# EAGLE design Battery board V4.1 - simple signals (EAGLE 7.6.0)
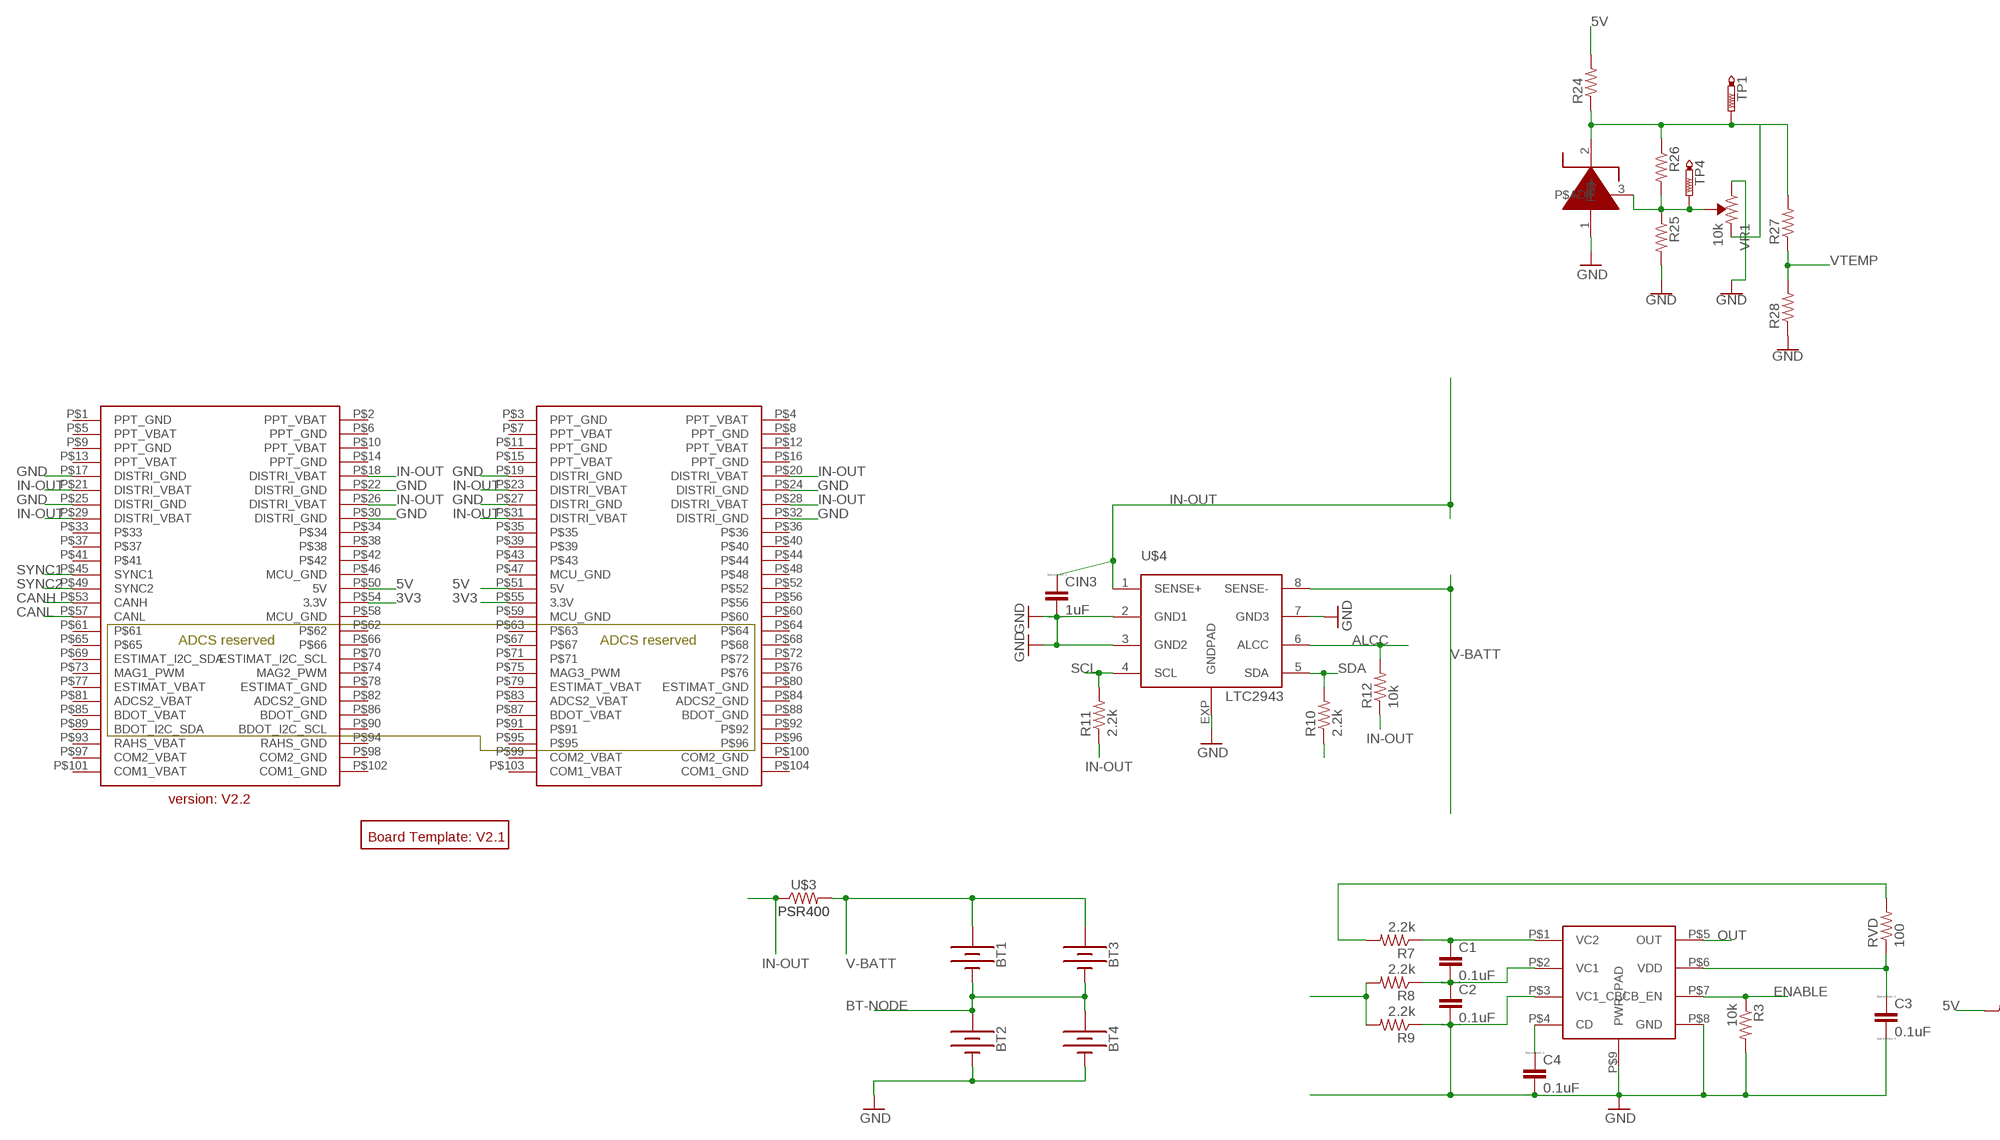
[diagram p0: schematic, sheet 1, part 1 of 2]
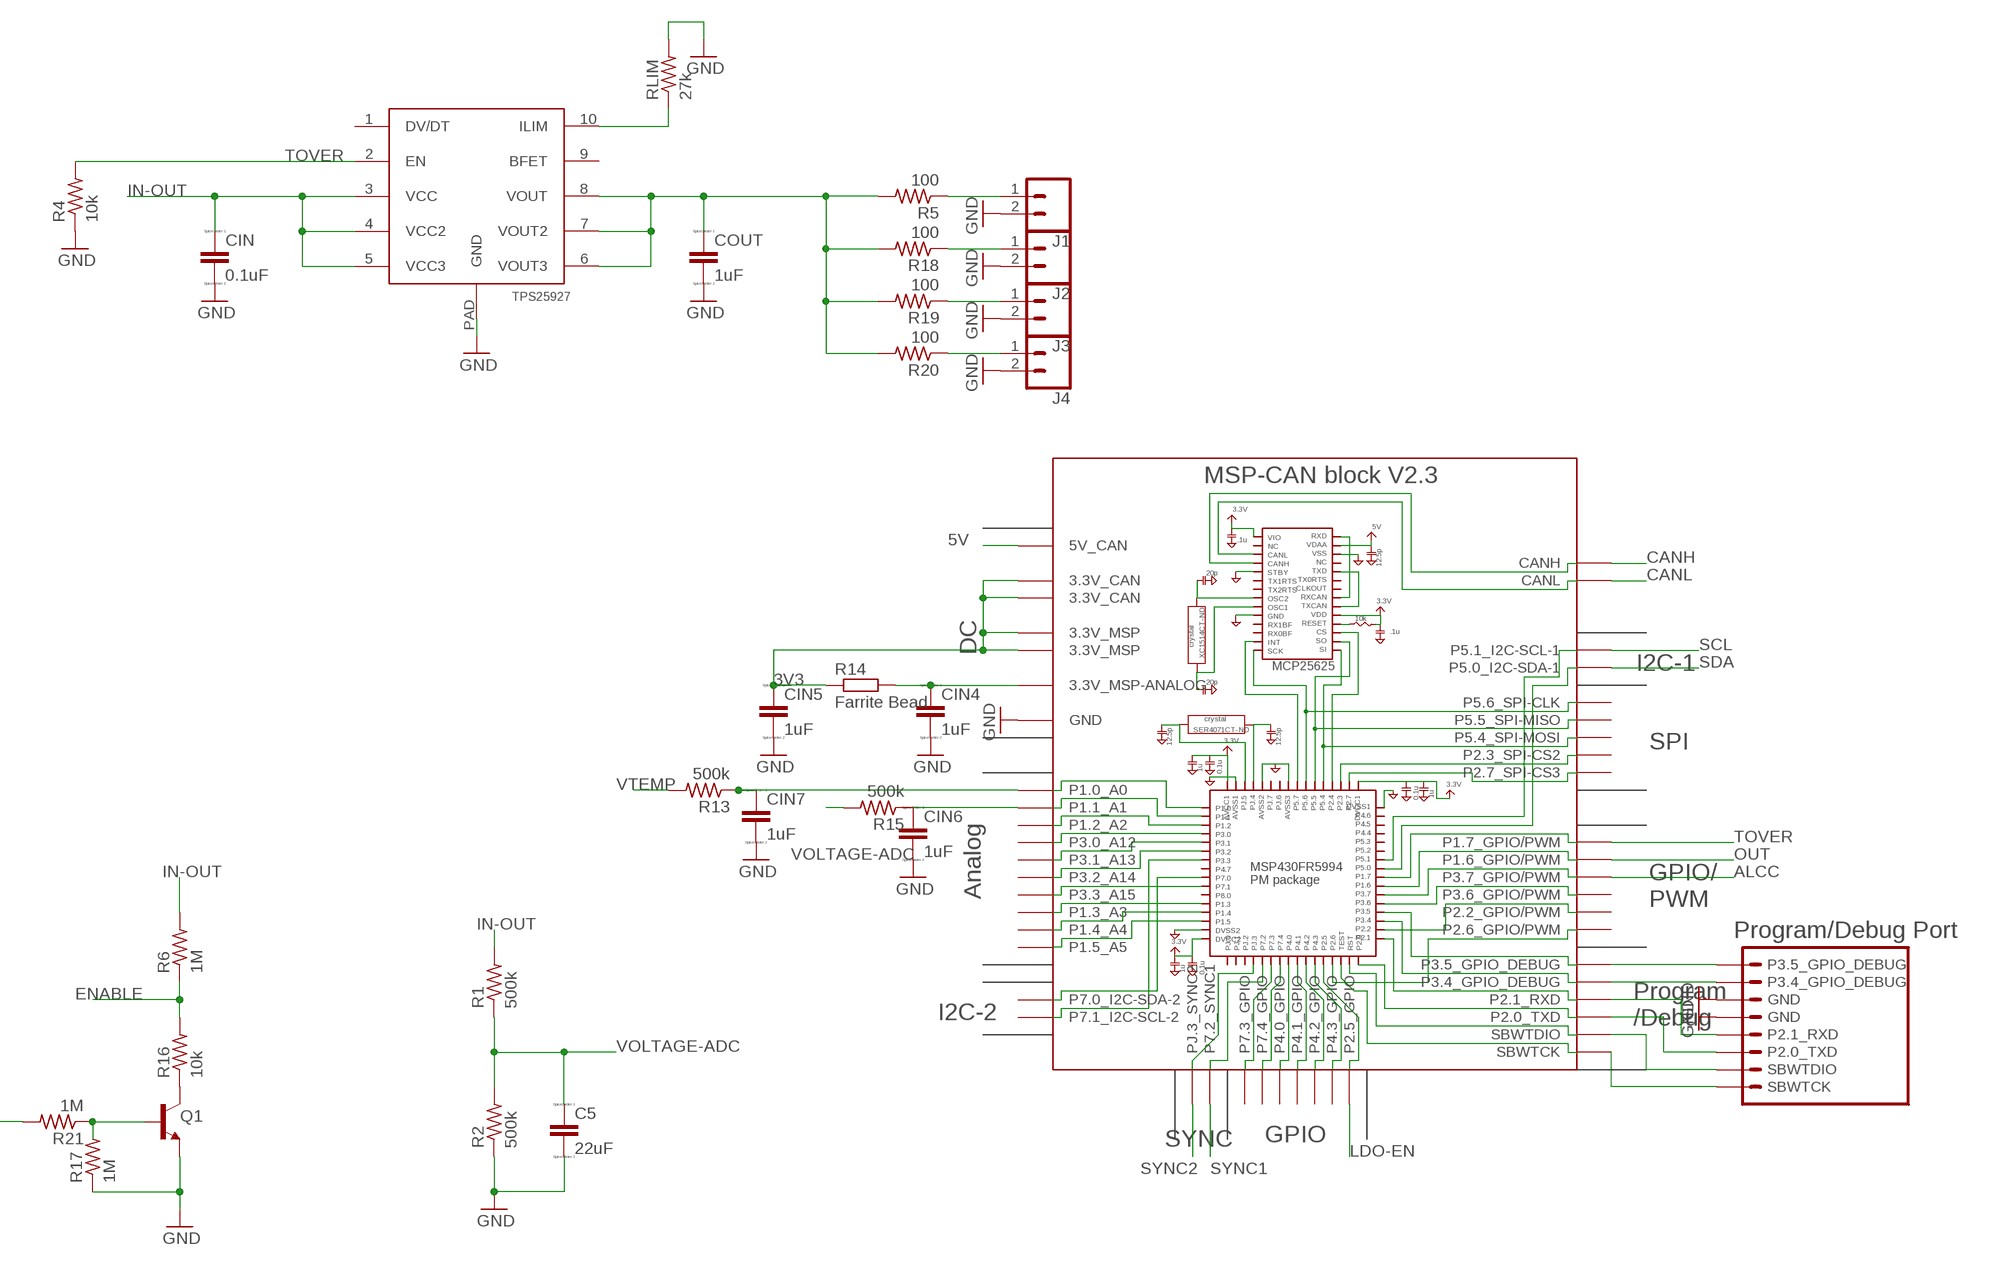
[diagram p1: schematic, sheet 1, part 2 of 2]

## Parts
BT1  BATTERY-18650  [BATTERY_18650-HOLDER]
BT2  BATTERY-18650  [BATTERY_18650-HOLDER]
BT3  BATTERY-18650  [BATTERY_18650-HOLDER]
BT4  BATTERY-18650  [BATTERY_18650-HOLDER]
C1  0.1uF  C  [C0805]
C2  0.1uF  C  [C0805]
C3  0.1uF  C  [C0805]
C4  0.1uF  C  [C0805]
C5  22uF  CC1206  [C1206]
CIN  0.1uF  C  [C0805]
CIN3  1uF  C  [C0805]
CIN4  1uF  C  [C0805]
CIN5  1uF  C  [C0805]
CIN6  1uF  C  [C0805]
CIN7  1uF  C  [C0805]
COUT  1uF  C  [C0805]
J1  CONN_02PTH3  [1X02_LONGPADS]
J2  CONN_02PTH3  [1X02_LONGPADS]
J3  CONN_02PTH3  [1X02_LONGPADS]
J4  CONN_02PTH3  [1X02_LONGPADS]
Q1  TRANS_NPN-MMBT2222AL  [SOT23-3]
R1  500k  R-US_R0805  [R0805]
R2  500k  R-US_R0805  [R0805]
R3  10k  R-US_R0805  [R0805]
R4  10k  R-US_R0805  [R0805]
R5  100  R-US_R0805  [R0805]
R6  1M  R-US_R0805  [R0805]
R7  2.2k  R-US_R0805  [R0805]
R8  2.2k  R-US_R0805  [R0805]
R9  2.2k  R-US_R0805  [R0805]
R10  2.2k  R-US_R0805  [R0805]
R11  2.2k  R-US_R0805  [R0805]
R12  10k  R-US_R0805  [R0805]
R13  500k  R-US_R0805  [R0805]
R14  Farrite Bead  R-EU_R1206  [R1206]
R15  500k  R-US_R0805  [R0805]
R16  10k  R-US_R0805  [R0805]
R17  1M  R-US_M0805  [M0805]
R18  100  R-US_R0805  [R0805]
R19  100  R-US_R0805  [R0805]
R20  100  R-US_R0805  [R0805]
R21  1M  R-US_M0805  [M0805]
R24  R-US_R0805  [R0805]
R25  R-US_R0805  [R0805]
R26  R-US_R0805  [R0805]
R27  R-US_R0805  [R0805]
R28  R-US_R0805  [R0805]
RLIM  27k  R-US_R0805  [R0805]
RVD  100  R-US_R0805  [R0805]
TP1  PTR1PAD1-13Y  [P1-13Y]
TP4  PTR1PAD1-13Y  [P1-13Y]
U$1  MSP-CAN_BLOCK  [MSP-CAN_BLOCK]
U$2  PROGRAM/DEBUG_PORT  [1X08_CONNECTOR]
U$3  PSR400  [PSR400]
U$4  LTC2943  [DFN8(3X3)LT]
U$5  TPS252927  [VSON10]
U$7  2X26_CONNECTOR_(V2.2)  [4X26_CONNECTOR_(V2.2)]
U$8  BQ29209  [VSON8]
U$9  BOARD_TEMPLATE_(V2.1)  [BOARD_TEMPLATE_(V2.1)]
U$10  LM135Z  [TO-92-3]
VR1  10k  TRIMPOT-SMD-3MM-OPEN-1/10W-25%  [TRIMPOT-SMD-TC33X]

## Nets
3V3: CIN5.1 R14.1 U$1.3.3V@CAN1(3.3V_CAN) U$1.3.3V@CAN2(3.3V_CAN) U$1.3.3V@MSP1(3.3V_MSP) U$1.3.3V@MSP2(3.3V_MSP) U$7.P$54(3.3V) U$7.P$55(3.3V)
5V: R21.2 R24.2 U$1.5V(5V_CAN) U$7.P$50(5V) U$7.P$51(5V)
ALCC: R12.2 U$1.P3.7_GPIO/PWM U$4.6(ALCC)
BASE: Q1.1(B) R17.2 R21.1
BT-NODE: BT1.GND@1(-) BT2.PWR@1(+) BT3.GND@1(-) BT4.PWR@1(+) R8.2 R9.2
CANH: U$1.CANH U$7.P$53(CANH)
CANL: U$1.CANL U$7.P$57(CANL)
ENABLE: R3.1 R6.1 R16.2 U$8.P$7(CB_EN)
FERRITE-BEAD: CIN4.1 R14.2 U$1.3.3V_ANALOG@MSP2(3.3V_MSP-ANALOG)
GND: BT2.GND@1(-) BT4.GND@1(-) C2.2 C3.2 C4.2 C5.2 CIN3.2 CIN4.2 CIN5.2 CIN6.2 CIN7.2 CIN.2 COUT.2 J1.2 J2.2 J3.2 J4.2 Q1.2(E) R2.1 R3.2 R4.1 R9.1 R17.1 R25.2 R28.1 RLIM.2 U$1.GND@1(GND) U$1.GND@2(GND) U$1.GND@3(GND) U$1.GND@4(GND) U$1.GND@5(GND) U$1.GND@7(GND) U$1.GND@8(GND) U$1.GND@9(GND) U$1.GND@10(GND) U$1.GND@11(GND) U$1.GND@12(GND) U$1.GND@13(GND) U$1.GND@14(GND) U$1.GND@15(GND) U$1.GND@16(GND) U$1.GND@17(GND) U$1.GND@26(GND) U$2.5(GND) U$2.6(GND) U$4.2(GND1) U$4.3(GND2) U$4.7(GND3) U$4.EXP(GNDPAD) U$5.PAD(GND) U$7.P$17(DISTRI_GND) U$7.P$19(DISTRI_GND) U$7.P$22(DISTRI_GND) U$7.P$24(DISTRI_GND) U$7.P$25(DISTRI_GND) U$7.P$27(DISTRI_GND) U$7.P$30(DISTRI_GND) U$7.P$32(DISTRI_GND) U$8.P$3(VC1_CB) U$8.P$8(GND) U$8.P$9(PWR_PAD) U$10.1(P$-) VR1.1(CW)
HEATER1: J3.1 R19.1
IN-OUT: CIN3.1 CIN.1 R1.2 R6.2 R10.1 R11.1 R12.1 U$3.P$1 U$4.1(SENSE+) U$5.3(VCC) U$5.4(VCC2) U$5.5(VCC3) U$7.P$18(DISTRI_VBAT) U$7.P$20(DISTRI_VBAT) U$7.P$21(DISTRI_VBAT) U$7.P$23(DISTRI_VBAT) U$7.P$26(DISTRI_VBAT) U$7.P$28(DISTRI_VBAT) U$7.P$29(DISTRI_VBAT) U$7.P$31(DISTRI_VBAT)
LDO-EN: U$1.P2.5_GPIO
N$3: J1.1 R5.1
N$4: C1.1 R7.1 U$8.P$1(VC2)
N$5: C1.2 C2.1 R8.1 U$8.P$2(VC1)
N$6: C3.1 RVD.1 U$8.P$6(VDD)
N$7: Q1.3(C) R16.1
N$8: C4.1 U$8.P$4(CD)
N$9: COUT.1 R5.2 R18.2 R19.2 R20.2 U$5.6(VOUT3) U$5.7(VOUT2) U$5.8(VOUT)
N$10: RLIM.1 U$5.10(ILIM)
N$11: J2.1 R18.1
N$12: J4.1 R20.1
N$14: U$1.P3.5_GPIO_DEBUG U$2.8(P3.5_GPIO_DEBUG)
N$15: U$1.P3.4_GPIO_DEBUG U$2.7(P3.4_GPIO_DEBUG)
N$19: U$1.P2.1_RXD U$2.4(P2.1_RXD)
N$20: U$1.P2.0_TXD U$2.3(P2.0_TXD)
N$21: U$1.SBWTDIO U$2.2(SBWTDIO)
N$22: U$1.SBWTCK U$2.SBWTCK
N$23: R24.1 R26.1 R27.2 TP1.TP U$10.2(P$+) VR1.3(CCW)
N$24: R25.1 R26.2 TP4.TP U$10.3(P$ADJ) VR1.2(WIPER)
OUT: U$1.P1.6_GPIO/PWM U$8.P$5(OUT)
SCL: R11.2 U$1.P5.1_I2C-SCL-1 U$4.4(SCL)
SDA: R10.2 U$1.P5.0_I2C-SDA-1 U$4.5(SDA)
SYNC1: U$1.P7.2_SYNC1 U$7.P$45(SYNC1)
SYNC2: U$1.PJ.3_SYNC2 U$7.P$49(SYNC2)
TOVER: R4.2 U$1.P1.7_GPIO/PWM U$5.2(EN)
V-BATT: BT1.PWR@1(+) BT3.PWR@1(+) R7.2 RVD.2 U$3.P$2 U$4.8(SENSE-)
VOLTAGE-ADC: C5.1 R1.1 R2.2 R15.2
VOLTAGE-ADC_FILTERED: CIN6.1 R15.1 U$1.P1.1_A1
VTEMP: R13.2 R27.1 R28.2
VTEMP_FILTERED: CIN7.1 R13.1 U$1.P1.0_A0
Unconnected: U$1.P1.2_A2 U$1.P1.3_A3 U$1.P1.4_A4 U$1.P1.5_A5 U$1.P2.2_GPIO/PWM U$1.P2.4_SPI-CS2(P2.3_SPI-CS2) U$1.P2.6_GPIO/PWM U$1.P2.7_SPI-CS3 U$1.P3.0_A12 U$1.P3.1_A13 U$1.P3.2_A14 U$1.P3.3_A15 U$1.P3.6_GPIO/PWM U$1.P4.0_GPIO U$1.P4.1_GPIO U$1.P4.2_GPIO U$1.P4.3_GPIO U$1.P5.4_SPI-MOSI U$1.P5.5_SPI-MISO U$1.P5.6_SPI-CLK U$1.P7.0_I2C-SDA-2 U$1.P7.1_I2C-SCL-2 U$1.P7.3_GPIO U$1.P7.4_GPIO U$5.1(DV/DT) U$5.9(BFET) U$7.P$1(PPT_GND) U$7.P$2(PPT_VBAT) U$7.P$3(PPT_GND) U$7.P$4(PPT_VBAT) U$7.P$5(PPT_VBAT) U$7.P$6(PPT_GND) U$7.P$7(PPT_VBAT) U$7.P$8(PPT_GND) U$7.P$9(PPT_GND) U$7.P$10(PPT_VBAT) U$7.P$11(PPT_GND) U$7.P$12(PPT_VBAT) U$7.P$13(PPT_VBAT) U$7.P$14(PPT_GND) U$7.P$15(PPT_VBAT) U$7.P$16(PPT_GND) U$7.P$33 U$7.P$34 U$7.P$35 U$7.P$36 U$7.P$37 U$7.P$38 U$7.P$39 U$7.P$40 U$7.P$41 U$7.P$42 U$7.P$43 U$7.P$44 U$7.P$46(MCU_GND) U$7.P$47(MCU_GND) U$7.P$48 U$7.P$52 U$7.P$56 U$7.P$58(MCU_GND) U$7.P$59(MCU_GND) U$7.P$60 U$7.P$61 U$7.P$62 U$7.P$63 U$7.P$64 U$7.P$65 U$7.P$66 U$7.P$67 U$7.P$68 U$7.P$69(ESTIMAT_I2C_SDA) U$7.P$70(ESTIMAT_I2C_SCL) U$7.P$71 U$7.P$72 U$7.P$73(MAG1_PWM) U$7.P$74(MAG2_PWM) U$7.P$75(MAG3_PWM) U$7.P$76 U$7.P$77(ESTIMAT_VBAT) U$7.P$78(ESTIMAT_GND) U$7.P$79(ESTIMAT_VBAT) U$7.P$80(ESTIMAT_GND) U$7.P$81(ADCS2_VBAT) U$7.P$82(ADCS2_GND) U$7.P$83(ADCS2_VBAT) U$7.P$84(ADCS2_GND) U$7.P$85(BDOT_VBAT) U$7.P$86(BDOT_GND) U$7.P$87(BDOT_VBAT) U$7.P$88(BDOT_GND) U$7.P$89(BDOT_I2C_SDA) U$7.P$90(BDOT_I2C_SCL) U$7.P$91 U$7.P$92 U$7.P$93(RAHS_VBAT) U$7.P$94(RAHS_GND) U$7.P$95 U$7.P$96 U$7.P$97(COM2_VBAT) U$7.P$98(COM2_GND) U$7.P$99(COM2_VBAT) U$7.P$100(COM2_GND) U$7.P$101(COM1_VBAT) U$7.P$102(COM1_GND) U$7.P$103(COM1_VBAT) U$7.P$104(COM1_GND)

## Library data of the parts
BT1-BT4 = SparkFun-Batteries:BATTERY: Battery - Single Cell A variety of battery chemistries, sizes, and footprints. Device List: 20MM_PTH - Coin Cell Battery Holder - 20mm (PTH) <https://www.sparkfun.com/products/783> 12MM_SMD - Coin Cell Battery Holder - 12mm (SMD) <https://www.sparkfun.com/products/10592> 12MM_PTH - Coin Cell Battery Holder - 12mm (PTH) <https://www.sparkfun.com/products/7948> 20MM_SMD - 20mm Coin Cell Battery Holder (SMD) (2 legs) Used on the Big Time Watch Kit <https://www.sparkfun.com/products/11734> 20MM_SMD_4LEGS - Coin Cell Battery Holder - 20mm (SMD) <https://www.sparkfun.com/products/11892> 20MM_SMD_4LEGS_OVERPASTE - Coin Cell Battery Holder - 20mm (SMD) <https://www.sparkfun.com/products/11892> (Over-paste on the legs) 24.5MM_PTH - Coin Cell Battery Holder - 24.5mm (PTH) <https://www.sparkfun.com/products/8863> 9V - 9V Battery Holder - PC Mount Used on the SparkFun SparkPunk Sound Kit <https://www.sparkfun.com/products/11177> and SparkFun SparkPunk Sequencer Kit <https://www.sparkfun.com/products/12707> 18650 - Battery Holder - 18650 (PTH) <https://www.sparkfun.com/products/13113> AA - Battery Holder - 1xAA (PTH) <https://www.sparkfun.com/products/7949> AAA - Battery Holder - 1xAAA (PTH) <https://www.sparkfun.com/products/12718> AA_KIT - Battery Holder - 1xAA (PTH) <https://www.sparkfun.com/products/7949> Special kit package - pads only have exposed copper on one side of the board. AAA_KIT - Battery Holder - 1xAAA (PTH) <https://www.sparkfun.com/products/12718> Special kit package - pads only have exposed copper on one side of the board.; PROD_ID: BATT-12327; SF_SKU: PRT-13113
C1-C5 CIN CIN3-CIN7 COUT = eagle-ltspice:C: CAPACITOR, European symbol; SPICEMODEL: NONE; SPICEPREFIX: C
J1-J4 = SparkFun-Connectors:CONN_02: Multi connection point. Often used as Generic Header-pin footprint for 0.1 inch spaced/style header connections On any of the 0.1 inch spaced packages, you can populate with these: Break Away Headers - Straight <https://www.sparkfun.com/products/116> (PRT-00116) Break Away Male Headers - Right Angle <https://www.sparkfun.com/products/553> (PRT-00553) Female Headers <https://www.sparkfun.com/products/115> (PRT-00115) Break Away Headers - Machine Pin <https://www.sparkfun.com/products/117> (PRT-00117) Break Away Female Headers - Swiss Machine Pin <https://www.sparkfun.com/products/743> (PRT-00743) For SCREWTERMINALS and SPRING TERMINALS visit here: Screw Terimnals on SparkFun.com <https://www.sparkfun.com/search/results?term=Screw+Terminals> (5mm/3.5mm/2.54mm spacing) This device is also useful as a general connection point to wire up your design to another part of your project. Our various solder wires solder well into these plated through hole pads. Hook-Up Wire - Assortment (Stranded, 22 AWG) <https://www.sparkfun.com/products/11375> (PRT-11375) Hook-Up Wire - Assortment (Solid Core, 22 AWG) <https://www.sparkfun.com/products/11367> (PRT-11367) View the entire wire category on our website here <https://www.sparkfun.com/categories/141> Special notes: Molex polarized connector foot print use with: PRT-08233 with associated crimp pins and housings. 2.54_SCREWTERM for use with PRT-10571. 3.5mm Screw Terminal footprints for PRT-08084 5mm Screw Terminal footprints for use with PRT-08432
Q1 = SparkFun-DiscreteSemi:TRANS_NPN: NPN transistor Current controlled devices typically used to amplify current or used as a switch. BC547 - COM-08928 <http://www.sparkfun.com/products/8928> (TO-92 45V 100mA) (1.Collector 2.Base 3.Emitter) 2N3904 - COM-00521 <http://www.sparkfun.com/products/521> (TO-92 40V 200mA) (1.Emitter 2.Base 3.Collector) P2N2222A - COM-12852 <http://www.sparkfun.com/products/12852> (TO-92 40V 600mA) (1.Collector 2.Base 3.Emitter); PROD_ID: TRANS-08049; VALUE: 600mA/40V
R1-R13 R15-R21 R24-R28 RLIM RVD = rcl:R-US_: RESISTOR, American symbol
R14 = rcl:R-EU_: RESISTOR, European symbol
TP1 TP4 = testpad:PTR1: TEST PIN
U$1 = CubeSat(V2.2) (2):MSP-CAN_BLOCK
U$2 = CubeSat(V2.2) (2):PROGRAM/DEBUG_PORT
U$3 = Parts for Power Team1:PSR400
U$4 = Parts for Power Team1:LTC2943
U$5 = Parts for Power Team1:TPS252927: http://www.ti.com/product/tps25927/datasheet
U$7 = CubeSat(V2.2) (2):2X26_CONNECTOR_(V2.2)
U$8 = Parts for Power Team1:BQ29209
U$9 = CubeSat(V2.2) (2):BOARD_TEMPLATE_(V2.1)
U$10 = Parts for Power Team1:LM135Z
VR1 = SparkFun-Resistors:TRIMPOT: Trimming Potentiometer (Trimpot) Three-terminal potentiometers, with an adjustable wiper and two adjustable resistors. A pot can be used to create a configurable voltage divider, or as a variable resistor. "Trimpots" are a subset of potentiometers, usually intended for "set-and-forget" applications. They're often more delicate than standard potentiometers - rated for fewer turns. Variants PTH-KNOB - PTH Trimpot w/ finger-adjustable knob Trimpot 10K with Knob <https://www.sparkfun.com/products/9806> (COM-09806) Datasheet <http://www.sparkfun.com/datasheets/Components/General/TSR-3386.pdf> SMD-3MM-CLOSED-FRAME - SMD 3mm Square Closed-Frame Trimpot Used on e.g. EasyDriver - Stepper Motor Driver <https://www.sparkfun.com/products/12779> Datasheet <http://www.bitechnologies.com/pdfs/22.pdf> (22AR10KTR) SMD-5MM - SMD 5mm Square Closed-Frame Trimpot Used on e.g. IOIO-OTG - V2.2 <https://www.sparkfun.com/products/13613> Datasheet <http://www.vishay.com/docs/51008/ts53.pdf> (TS53YL502MR10) SMD-3MM-1/10W-25% - 3mm Square Open-Frame Trimpot Used on e.g. SparkFun Shapeoko <https://www.sparkfun.com/products/13899> Datasheet <http://www.bourns.com/docs/Product-Datasheets/TC33.pdf> (TC33X-2-103E); PROD_ID: RES-12428

## Board
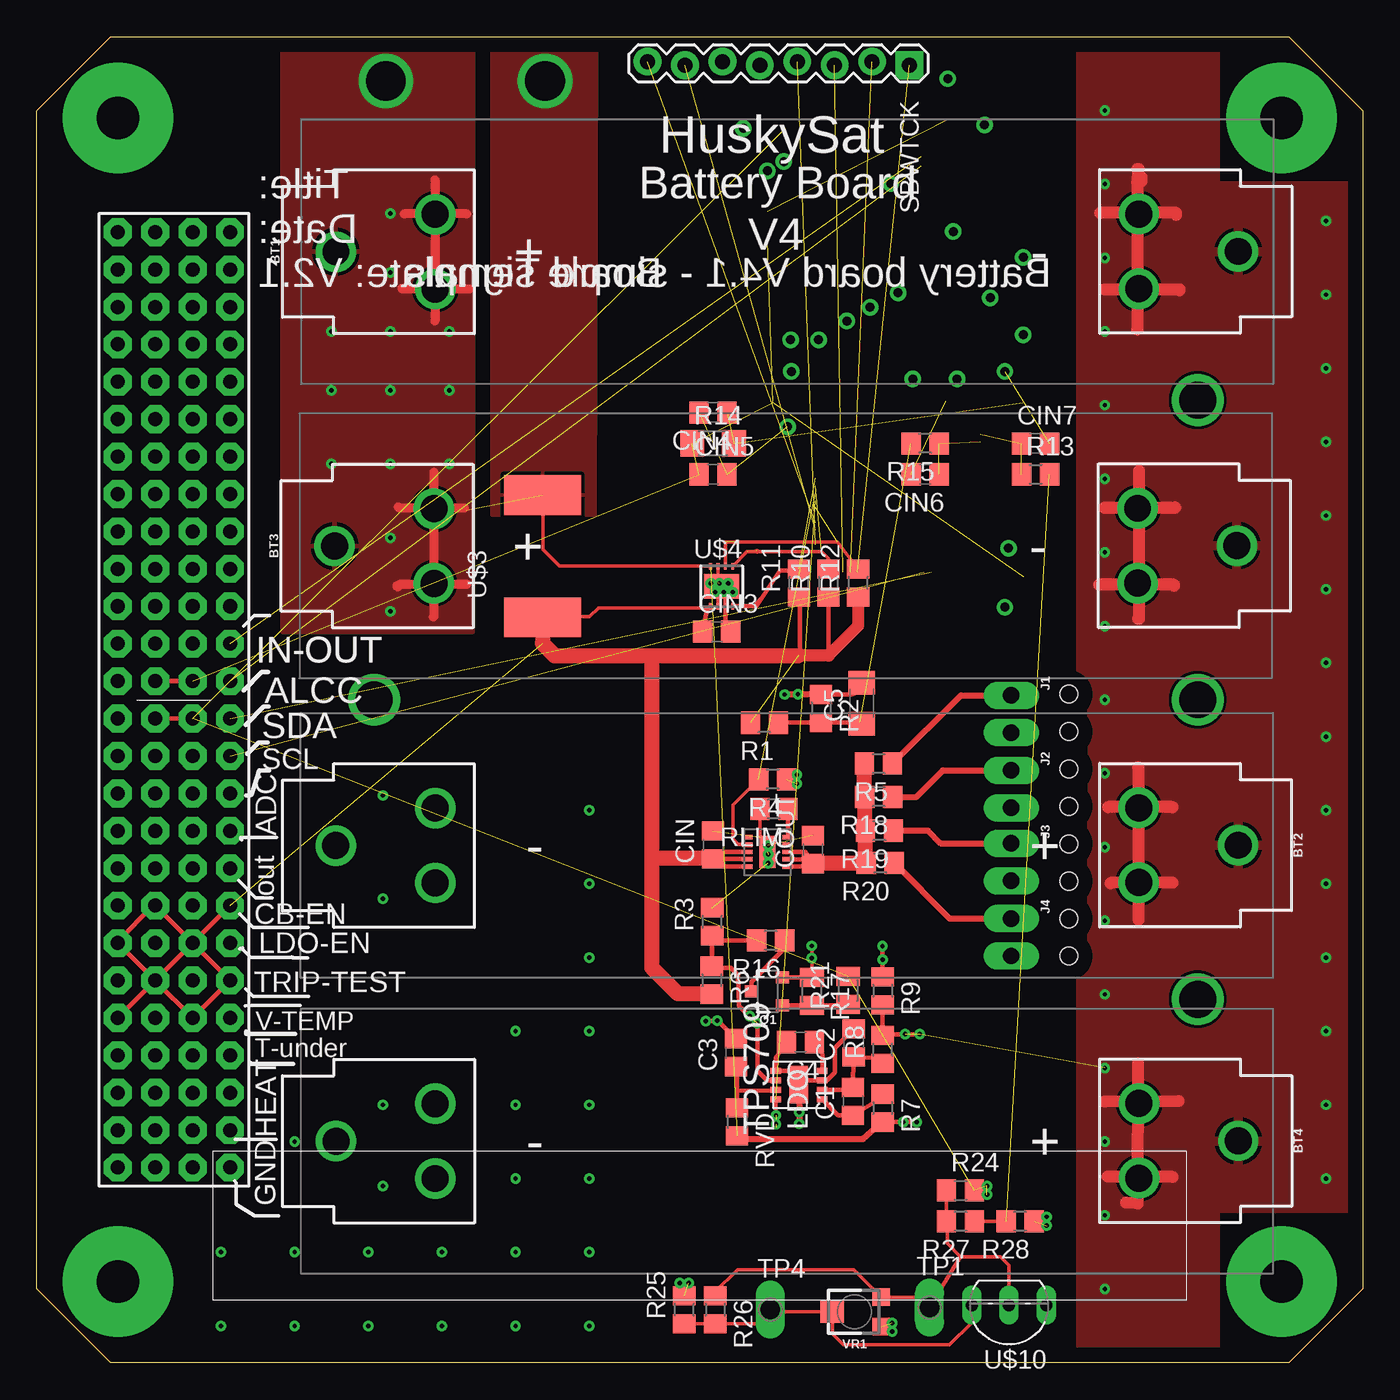
[diagram p2: board, top side]
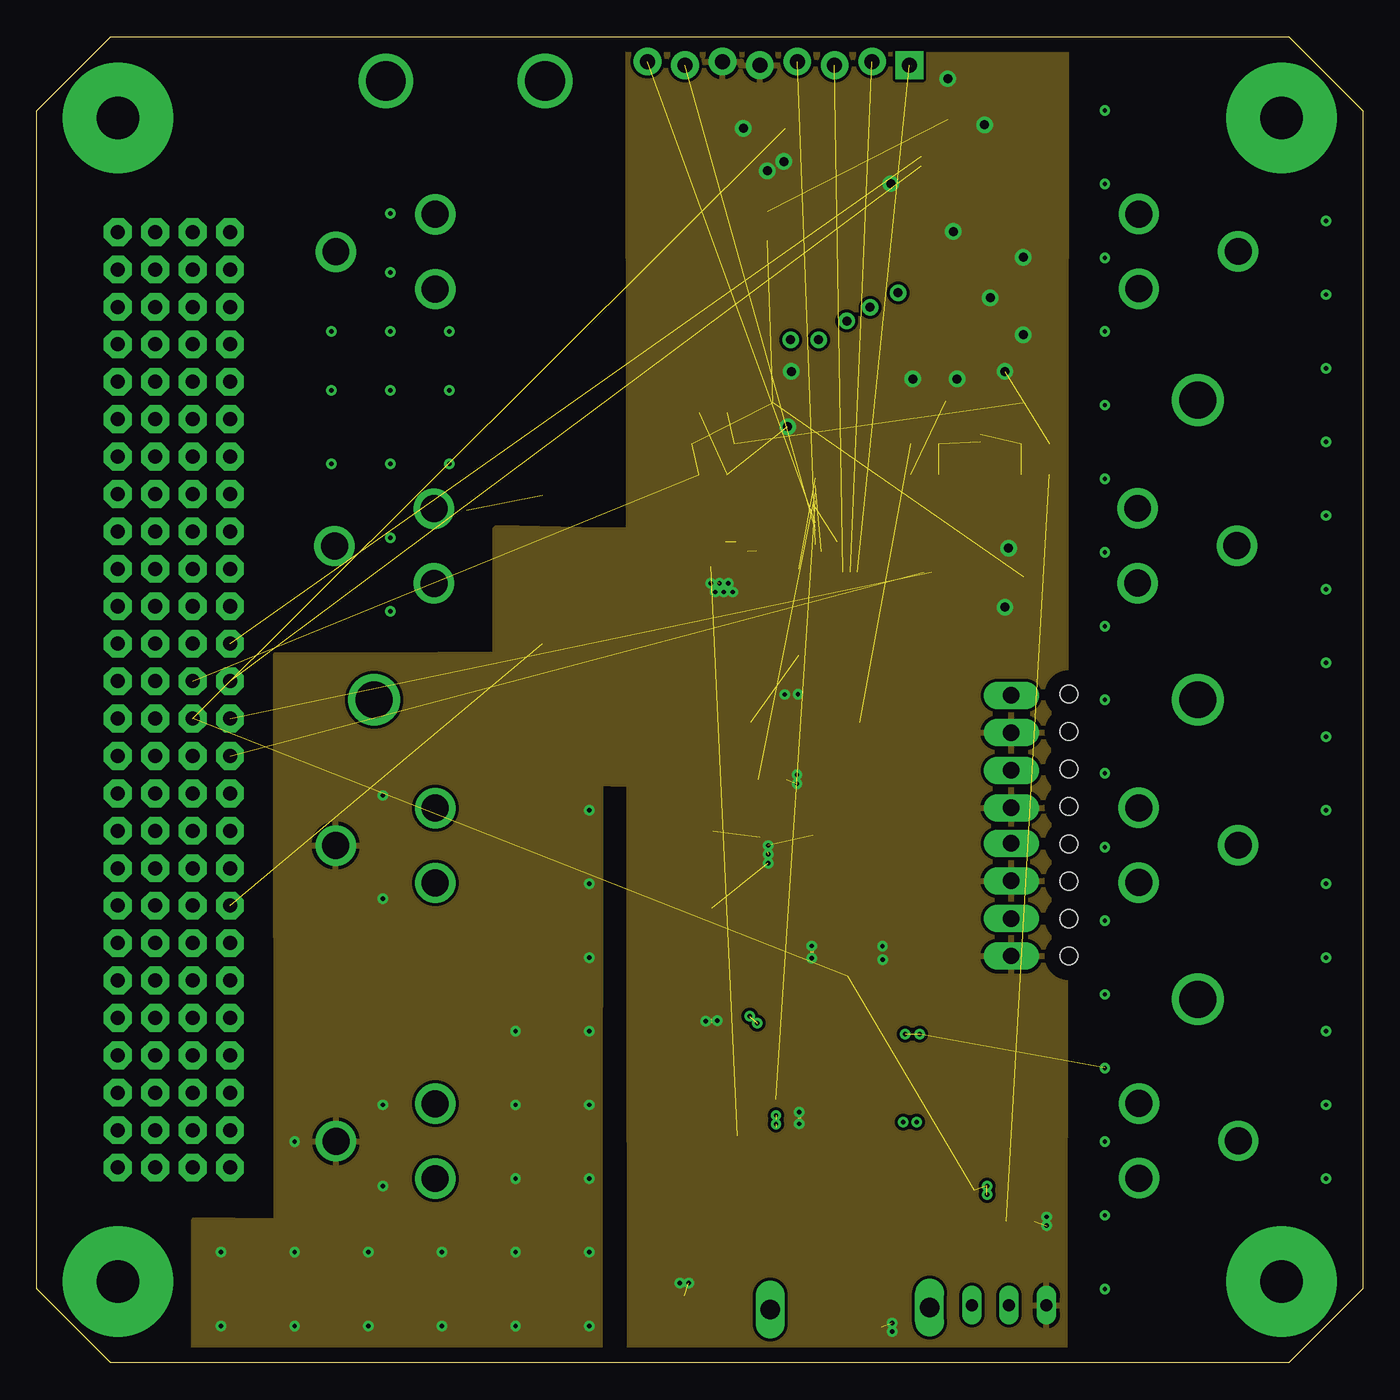
[diagram p3: board, inner layer Route2]
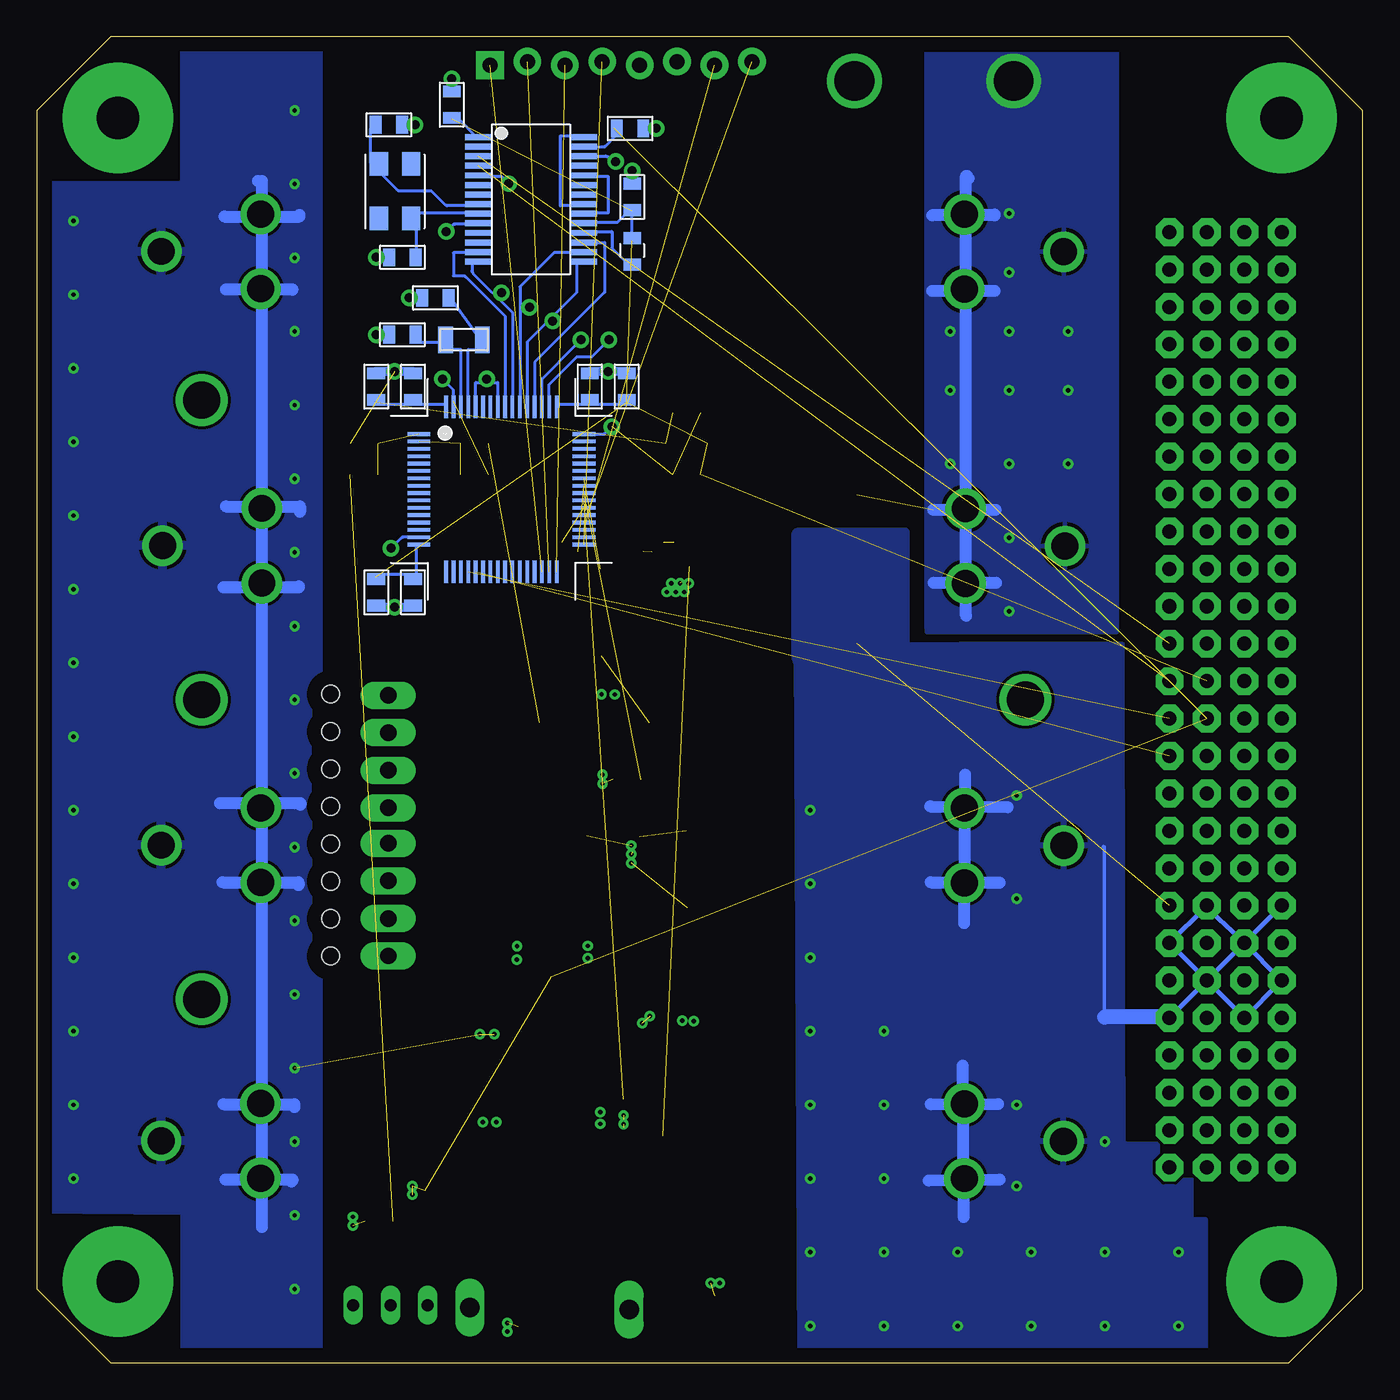
[diagram p4: board, bottom side, seen from below]

Size 90 x 90 mm. Coordinates in mm from the lower left corner, seen from the top.
Copper layers (1*2*15*16): Top 0.035mm / dielectric 0.5mm / Route2 0.035mm / dielectric 0.5mm / Route15 0.035mm / dielectric 0.5mm / Bottom 0.035mm
Design rules "default *": minimum track width 10mil, minimum drill 24mil, track to track 8mil, track to pad 8mil, pad to pad 8mil, via to via 8mil, smd to smd 8mil, copper to edge 40mil, drill to drill 8mil, minimum pad ring 10mil, minimum via ring 8mil, stop-mask expansion 4mil, vias tented up to drill 0mil, thermal gap 10mil
Holes 1.2 mm at 70.05,27.6 70.05,30.14 70.05,32.68 70.05,35.22 70.05,37.76 70.05,40.3 70.05,42.84 70.05,45.38

### Footprints (pad centres in the part's own frame; a part is rotated, then mirrored left to right if it is on the bottom)
BATTERY_18650-HOLDER = drill 1.829: GND@1 30.628,0.01; GND@2 23.88,2.55; GND@3 23.88,-2.53; PWR@1 -30.628,-0.01; PWR@2 -23.88,2.53; PWR@3 -23.88,-2.55
C0805 = smd 1.3 x 1.5: 1 -0.95,0; 2 0.95,0
C1206 = smd 1.6 x 1.8: 1 -1.4,0; 2 1.4,0
1X02_LONGPADS = drill 1.118 pad 1.88 long: 1 0,0; 2 2.54,0
SOT23-3 = smd 0.8 x 0.9: 1 -0.95,-1; 2 0.95,-1; 3 0,1.1
R0805 = smd 1.3 x 1.5: 1 -0.95,0; 2 0.95,0
R1206 = smd 1.6 x 1.803: 1 -1.422,0; 2 1.422,0
M0805 = smd 1.3 x 1.6: 1 -0.95,0; 2 0.95,0
P1-13Y = drill 1.321 pad 1.905 long: TP 0,0
MSP-CAN_BLOCK = smd 1.2 x 0.8: 1 -6,6.08; 2 -6,7.88; 3 -8.5,6.08; 4 -8.5,7.88; 9 -8.5,-6.08; 10 -8.5,-7.88; 11 -6,-6.08; 12 -6,-7.88; 13 8.5,6.08; 14 8.5,7.88; 15 6,6.08; 16 6,7.88; 23 8.875,18.955; 24 8.875,20.755; 25 8.875,17.045; 26 8.875,15.245; 27 -3.375,25.205; 28 -3.375,27.005 | smd 1 x 0.25: 3.3V@CAN1 -3.375,25.125; 3.3V@CAN2 8.875,18.875; 3.3V@MSP1 8.501,5.884; 3.3V@MSP2 -8.533,-5.962; 3.3V_ANALOG@MSP2 -8.482,5.904 | smd 0.8 x 1.2: 5 -5.83,10.5; 6 -7.63,10.5; 7 -3.58,13; 8 -5.38,13; 17 -8.545,24.75; 18 -6.745,24.75; 19 -5.83,15.75; 20 -7.63,15.75; 21 7.83,24.5; 22 9.63,24.5 | smd 0.25 x 1: 5V 7.65,24.5 | smd 1.75 x 0.4: CANH -1.6,21.96; CANL -1.6,22.61; P$65 -1.6,23.91; P$66 -1.6,23.26; P$69 -1.6,21.31; P$70 -1.6,20.66; P$71 -1.6,20.01; P$72 -1.6,19.36; P$73 -1.6,18.71; P$74 -1.6,18.06; P$75 -1.6,17.41; P$76 -1.6,16.76; P$77 -1.6,16.11; P$78 -1.6,15.46; P$79 5.6,15.46; P$80 5.6,16.11; P$81 5.6,16.76; P$82 5.6,17.41; P$83 5.6,18.06; P$84 5.6,18.71; P$85 5.6,19.36; P$86 5.6,20.01; P$87 5.6,20.66; P$88 5.6,21.31; P$89 5.6,21.96; P$90 5.6,22.61; P$91 5.6,23.26; P$92 5.6,23.91 | drill 0.61: GND@1 -3.375,27.875; GND@2 -5.875,24.75; GND@3 -3.75,17.5; GND@4 0.5,20.75; GND@5 -8.5,15.75; GND@7 -8.5,10.5; GND@8 -7.25,8; GND@9 -4,7.5; GND@10 -1,7.5; GND@11 7.75,22.25; GND@12 10.5,24.5; GND@13 8.875,21.625; GND@14 7.25,8; GND@15 7.5,4.25; GND@16 -7.5,-4; GND@17 -7.25,-8; GND@26 -6.25,13; P2.4_SPI-CS2 5.397,10.16; P2.7_SPI-CS3 7.303,10.16; P5.4_SPI-MOSI 3.487,11.434; P5.5_SPI-MISO 1.9,12.354; P5.6_SPI-CLK 0,13.348 | smd 1.55 x 0.25: P1.0_A0 -5.6,3.75; P1.1_A1 -5.6,3.25; P1.2_A2 -5.6,2.75; P1.3_A3 -5.6,-1.75; P1.4_A4 -5.6,-2.25; P1.5_A5 -5.6,-2.75; P1.6_GPIO/PWM 5.6,-0.75; P1.7_GPIO/PWM 5.6,-0.25; P2.1_RXD 5.6,-3.75; P2.2_GPIO/PWM 5.6,-3.25; P3.0_A12 -5.6,2.25; P3.1_A13 -5.6,1.75; P3.2_A14 -5.6,1.25; P3.3_A15 -5.6,0.75; P3.4_GPIO_DEBUG 5.6,-2.75; P3.5_GPIO_DEBUG 5.6,-2.25; P3.6_GPIO/PWM 5.6,-1.75; P3.7_GPIO/PWM 5.6,-1.25; P5.0_I2C-SDA-1 5.6,0.25; P5.1_I2C-SCL-1 5.6,0.75; P7.0_I2C-SDA-2 -5.6,-0.25; P7.1_I2C-SCL-2 -5.6,-0.75; P$8 -5.6,0.25; P$11 -5.6,-1.25; P$15 -5.6,-3.25; P$16 -5.6,-3.75; P$43 5.6,1.25; P$44 5.6,1.75; P$45 5.6,2.25; P$46 5.6,2.75; P$47 5.6,3.25; P$48 5.6,3.75 | smd 0.25 x 1.55: P2.0_TXD 3.75,-5.6; P2.5_GPIO 1.75,-5.6; P2.6_GPIO/PWM 2.25,-5.6; P4.0_GPIO -0.25,-5.6; P4.1_GPIO 0.25,-5.6; P4.2_GPIO 0.75,-5.6; P4.3_GPIO 1.25,-5.6; P7.2_SYNC1 -1.75,-5.6; P7.3_GPIO -1.25,-5.6; P7.4_GPIO -0.75,-5.6; P$17 -3.75,-5.6; P$18 -3.25,-5.6; P$19 -2.75,-5.6; P$49 3.75,5.6; P$50 3.25,5.6; P$51 2.75,5.6; P$52 2.25,5.6; P$53 1.75,5.6; P$54 1.25,5.6; P$55 0.75,5.6; P$56 0.25,5.6; P$57 -0.25,5.6; P$58 -0.75,5.6; P$59 -1.25,5.6; P$60 -1.75,5.6; P$61 -2.25,5.6; P$62 -2.75,5.6; P$63 -3.25,5.6; P$64 -3.75,5.6; PJ.3_SYNC2 -2.25,-5.6; SBWTCK 2.75,-5.6; SBWTDIO 3.25,-5.6 | smd 1 x 1.8: P$93 -3.79,10.16; P$94 -1.29,10.16 | smd 1.25 x 1.6: P$104 -6.13,18.38; P$105 -6.13,22.08; P$106 -8.33,22.08; P$107 -8.33,18.38
1X08_CONNECTOR = drill 1.016 pad 1.88: 2 2.54,-0.127; 3 5.08,0.127; 4 7.62,-0.127; 5 10.16,0.127; 6 12.7,-0.127; 7 15.24,0.127; 8 17.78,-0.127 | drill 1.016 pad 1.88 square: SBWTCK 0,0.127
PSR400 = smd 2.7 x 5.2: P$1 0,0; P$2 8.3,0
DFN8(3X3)LT = smd 0.25 x 0.45: 1 -2.02,-0.08; 2 -1.52,-0.08; 3 -1.02,-0.08; 4 -0.52,-0.08; 5 -0.52,2.62; 6 -1.02,2.62; 7 -1.52,2.62; 8 -2.02,2.62 | smd 2.38 x 1.65: EXP -1.27,1.27
VSON10 = smd 0.7 x 0.305: 1 0.2,2.575; 2 0.2,2.075; 3 0.2,1.575; 4 0.2,1.075; 5 0.2,0.575; 6 2.95,0.575; 7 2.95,1.075; 8 2.95,1.575; 9 2.95,2.075; 10 2.95,2.575 | smd 1.067 x 2.184: PAD 1.575,1.575
4X26_CONNECTOR_(V2.2) = drill 0.953 pad 1.88 octagon: P$1 -31.75,31.88; P$2 -31.75,34.42; P$3 -31.75,36.96; P$4 -31.75,39.5; P$5 -29.21,31.88; P$6 -29.21,34.42; P$7 -29.21,36.96; P$8 -29.21,39.5; P$9 -26.67,31.88; P$10 -26.67,34.42; P$11 -26.67,36.96; P$12 -26.67,39.5; P$13 -24.13,31.88; P$14 -24.13,34.42; P$15 -24.13,36.96; P$16 -24.13,39.5; P$17 -21.59,31.88; P$18 -21.59,34.42; P$19 -21.59,36.96; P$20 -21.59,39.5; P$21 -19.05,31.88; P$22 -19.05,34.42; P$23 -19.05,36.96; P$24 -19.05,39.5; P$25 -16.51,31.88; P$26 -16.51,34.42; P$27 -16.51,36.96; P$28 -16.51,39.5; P$29 -13.97,31.88; P$30 -13.97,34.42; P$31 -13.97,36.96; P$32 -13.97,39.5; P$33 -11.43,31.88; P$34 -11.43,34.42; P$35 -11.43,36.96; P$36 -11.43,39.5; P$37 -8.89,31.88; P$38 -8.89,34.42; P$39 -8.89,36.96; P$40 -8.89,39.5; P$41 -6.35,31.88; P$42 -6.35,34.42; P$43 -6.35,36.96; P$44 -6.35,39.5; P$45 -3.81,31.88; P$46 -3.81,34.42; P$47 -3.81,36.96; P$48 -3.81,39.5; P$49 -1.27,31.88; P$50 -1.27,34.42; P$51 -1.27,36.96; P$52 -1.27,39.5; P$53 1.27,31.88; P$54 1.27,34.42; P$55 1.27,36.96; P$56 1.27,39.5; P$57 3.81,31.88; P$58 3.81,34.42; P$59 3.81,36.96; P$60 3.81,39.5; P$61 6.35,31.88; P$62 6.35,34.42; P$63 6.35,36.96; P$64 6.35,39.5; P$65 8.89,31.88; P$66 8.89,34.42; P$67 8.89,36.96; P$68 8.89,39.5; P$69 11.43,31.88; P$70 11.43,34.42; P$71 11.43,36.96; P$72 11.43,39.5; P$73 13.97,31.88; P$74 13.97,34.42; P$75 13.97,36.96; P$76 13.97,39.5; P$77 16.51,31.88; P$78 16.51,34.42; P$79 16.51,36.96; P$80 16.51,39.5; P$81 19.05,31.88; P$82 19.05,34.42; P$83 19.05,36.96; P$84 19.05,39.5; P$85 21.59,31.88; P$86 21.59,34.42; P$87 21.59,36.96; P$88 21.59,39.5; P$89 24.13,31.88; P$90 24.13,34.42; P$91 24.13,36.96; P$92 24.13,39.5; P$93 26.67,31.88; P$94 26.67,34.42; P$95 26.67,36.96; P$96 26.67,39.5; P$97 29.21,31.88; P$98 29.21,34.42; P$99 29.21,36.96; P$100 29.21,39.5; P$101 31.75,31.88; P$102 31.75,34.42; P$103 31.75,36.96; P$104 31.75,39.5
VSON8 = smd 0.4 x 0.7: P$1 0,0; P$2 0.65,0; P$3 1.3,0; P$4 1.95,0; P$5 0,3.15; P$6 0.65,3.15; P$7 1.3,3.15; P$8 1.95,3.15 | smd 2.54 x 1.27: P$9 1,1.6
BOARD_TEMPLATE_(V2.1) = drill 2.9 pad 7.5: P$1 -39.5,39.5; P$2 -39.5,-39.5; P$3 39.5,-39.5; P$4 39.5,39.5
TO-92-3 = drill 0.813 long: 1 -2.54,0; 2 0,0; 3 2.54,0
TRIMPOT-SMD-TC33X = smd 1.2 x 1.2: 1 -1,-1.825; 3 1,-1.825 | smd 1.5 x 1.6: 2 0,1.5

### Placement (x,y rotation side)
BT1  50.93,75.42 0 top
BT2  50.92,35.12 180 top
BT3  50.84,55.44 0 top
BT4  50.93,15.05 180 top
C1  55.41,17.74 90 top
C2  55.45,21.71 90 top
C3  47.46,21.04 90 top
C4  51.85,21.76 180 top
C5  55.99,44.76 90 top
CIN  45.9,35.14 90 top
CIN3  46.15,49.62 0 top
CIN4  45.9,64.5 180 top
CIN5  45.9,60.3 0 top
CIN6  60.3,60.3 180 top
CIN7  67.8,62.4 0 top
COUT  52.68,34.82 90 top
J1  66.15,45.3 270 top
J2  66.15,40.2 270 top
J3  66.15,35.25 270 top
J4  66.15,30.15 270 top
Q1  49.62,25.21 90 top
R1  49.39,43.44 180 top
R2  53.24,44.41 270 top
R3  45.85,29.93 90 top
R4  49.95,39.6 180 top
R5  57.14,40.66 180 top
R6  45.82,25.96 270 top
R7  57.42,17.28 270 top
R8  57.42,21.26 90 top
R9  57.42,25.24 270 top
R10  53.75,52.92 90 top
R11  51.74,52.93 90 top
R12  55.76,52.93 90 top
R13  67.8,60.3 0 top
R14  45.9,62.4 0 top
R15  60.3,62.4 180 top
R16  49.82,28.66 180 top
R17  52.62,25.21 270 top
R18  57.15,38.41 180 top
R19  57.2,36.11 180 top
R20  57.25,33.91 180 top
R21  55.07,25.26 90 top
R24  62.7,11.7 0 top
R25  43.95,3.6 90 top
R26  46.05,3.6 270 top
R27  62.7,9.6 180 top
R28  66.75,9.6 180 top
RLIM  50.03,37.59 180 top
RVD  47.53,16.35 270 top
TP1  60.6,3.75 0 top
TP4  49.8,3.6 0 top
U$1  58.46,59.28 0 bottom
U$2  59.24,88.2 180 top
U$3  34.33,50.59 90 top
U$4  47.75,51.43 0 top
U$5  48.02,33.09 0 top
U$7  45,44.99 90 top
U$8  53.32,17.86 90 top
U$9  45,45 180 top
U$10  66,3.9 180 top
VR1  55.5,3.45 90 top

### Tracks (layer width: path | path; a pad name or v marks a point on that pad's centre or on a via)
3V3  (6 unrouted)
  Top 0.305: U$7.P$55 U$7.P$54
5V  (via drill 0.3)  (5 unrouted)
  Top 0.305: U$7.P$51 U$7.P$50
  other vias: 64.5,12 64.5,11.4
ALCC  (2 unrouted)
  Top 0.254: U$4.6 46.73,54.96 46.73,54.97 46.74,55.71 46.66,55.72 54.33,55.72 R12.2
  Top 0.305: 47.47,55.71 47.49,55.69 | 47.49,55.69
BASE
  Top 0.305: Q1.1 R17.2 55.02,24.26 R21.1
BT-NODE  (via drill 0.3)  (2 unrouted)
  Top 0.305: R9.2 R8.2 57.5,22.29 v59.94,22.29
  Top 0.813: 77.11,12.6 72.68,12.62 | 77.49,17.74 72.48,17.71 | 77.11,32.59 72.88,32.57 | 74.77,40.42 74.78,30.08 | 77.08,37.69 77.08,37.72 72.72,37.72 | 77.21,52.73 77.21,52.81 72.11,52.81 | 77.27,58.07 77.27,58.02 72.48,58.02 | 74.81,60.53 74.81,50.49 74.76,50.49 | 77.35,77.92 77.35,78.05 72.16,78.05 | 77.56,72.79 77.56,72.85 72.48,72.85 | 74.69,80.13 74.69,70.12 74.73,70.12 | 74.74,20.33 74.71,10.81 73.94,10.85 | 74.8,81.02 74.74,81.02 74.74,80.46 74.99,80.46 74.99,80.21
  Bottom 0.813: 74.99,80.21 74.72,80.21 74.72,9.19 | 77.28,77.8 72.17,77.8 72.17,77.91 | 77.17,72.87 72.64,72.87 72.64,72.83 | 77.17,58.13 72.13,58.13 72.13,57.77 | 77.32,52.65 72.2,52.65 72.2,52.69 | 77.57,37.98 72.09,37.98 72.09,37.87 | 77.39,32.61 72.24,32.61 72.24,32.4 | 77.32,17.55 72.53,17.55 72.53,17.33 | 77.21,12.43 72.64,12.43 72.64,12.36 72.71,12.36 72.71,12.29
  other vias: 72.5,35 72.5,40 72.5,30 72.5,25 72.5,20 72.5,15 72.5,10 72.5,5 72.5,45 72.5,50 72.5,55 72.5,60 72.5,65 72.5,70 72.5,75 72.5,80 72.5,85 87.5,67.5 87.5,62.5 87.5,57.5 87.5,52.5 87.5,47.5 87.5,42.5 87.5,37.5 87.5,32.5 87.5,27.5 87.5,22.5 87.5,17.5 87.5,12.5 87.5,72.5 87.5,77.5 58.95,22.29
  pour Top: 90.38,80.1 90.34,10.43 80.01,10.41 80.01,0.17 70.92,0.2 70.92,0.25 70.87,0.25 70.87,89.78 80,89.78 80,79.9 89.03,79.9 89.03,79.85
  pour Bottom: 90.38,80.1 90.34,10.43 79.95,10.35 79.95,0.12 70.92,0.2 70.92,0.25 70.87,0.25 70.87,89.78 80,89.78 80,79.9 89.03,79.9 89.03,79.85
CANH  (1 unrouted)
CANL  (1 unrouted)
ENABLE  (via drill 0.3)  (2 unrouted)
  Top 0.305: R16.2 46.17,28.66 R3.1 45.85,26.94 R6.1 45.92,26.81 47.12,26.81 47.61,26.32 47.66,24.21 48.92,23.01 48.92,19.81 49.57,19.16 U$8.P$7
  other vias: 48.9,23.05 48.38,23.51
FERRITE-BEAD  (2 unrouted)
  Bottom 0.254: U$1.3.3V_ANALOG@MSP2 67.27,65.19 67.29,65.16
GND  (via drill 0.3)  (13 unrouted)
  Top 0.254: U$4.2 46.23,52.45 U$4.EXP 46.23,52.95 U$4.7 | R17.1 v52.61,27.45 | v52.61,27.45 v52.61,28.29 | v52.61,27.45 52.59,27.43 | RLIM.2 49.08,35.67 v49.64,35.11
  Top 0.305: C4.2 50.17,20.73 U$8.P$8 51.72,19.81 U$8.P$9 52.02,19.16 U$8.P$3 53.64,19.16 54.16,19.69 54.16,21.38 C2.2 | C5.2 arc-90 55.19,45.36 R2.1 | Q1.2 R17.1 | CIN3.2 46.73,49.62 U$4.3 46.73,52.7 U$4.EXP | R9.1 57.42,27.9 57.42,27.94 57.41,28.21 v57.4,28.27 | C3.2 46.25,23.2 v45.41,23.2 | v46.18,23.21 v46.19,23.2 46.17,23.19 46.17,23.16
  Top 0.406: R2.1 51.53,45.36 51.52,45.35 51.46,45.35 v50.76,45.36 | 51.72,18.54 U$8.P$9 v51.76,16.21
  Route2 0.254: v51.75,17 v51.76,17 v51.76,16.21 | v52.61,28.29 52.64,28.26 | 52.64,28.26 | 52.64,28.26 52.61,28.23 v52.61,27.45
  Route2 0.305: v45.41,23.2 v45.4,23.2 45.42,23.21 v46.18,23.21
  Bottom 0.254: 17.53,23.46 17.53,35.02 17.6,35.02 17.6,35.05
  Bottom 0.305: U$7.P$22 U$7.P$25 10.66,30.94 | U$7.P$22 13.06,23.46 U$7.P$17 | U$7.P$27 U$7.P$22 | U$7.P$19 8.04,23.34 8.14,23.24 8.14,23.5 U$7.P$22 | U$7.P$24 5.58,26.03 | 5.58,26.03 U$7.P$27 | 5.58,26.03 5.58,25.85 8.09,23.34 | 8.09,23.34 8.09,23.33 | 8.09,23.34 8.09,23.39 8.1,23.4 | 10.66,30.94 U$7.P$30 | U$7.P$32 5.69,31.03 5.73,30.98 5.73,30.79 U$7.P$27 | 10.66,30.94 8.01,28.49 arc221 8.07,28.46
  Bottom 0.61: 27.09,9.9 27.09,9.93 | 27.06,29.84 27.03,29.82
  Bottom 0.813: 27.15,20.18 27.09,9.9 | 29.46,12.37 24.63,12.44 | 29.31,17.54 24.76,17.56 | 27,39.92 27.06,29.84 | 29.37,37.77 24.08,37.71 | 29.31,32.61 24.66,32.59
  Bottom 1.016: 13.06,23.46 17.53,23.46
  other vias: 49.64,33.91 49.64,34.51 45.74,52.91 46.34,52.91 46.94,52.91 46.04,52.31 46.64,52.31 47.24,52.31 51.67,45.37 57.41,27.36 37.5,17.5 32.5,12.5 37.5,12.5 37.5,7.5 32.5,7.5 32.5,2.5 37.5,2.5 27.5,7.5 27.5,2.5 22.5,7.5 22.5,2.5 17.5,2.5 17.5,7.5 12.5,2.5 12.5,7.5 32.5,17.5 32.5,22.5 37.5,22.5 37.5,27.5 37.5,32.5 37.5,37.5 23.5,17.5 23.5,31.5 23.5,38.5 17.5,15 23.5,12 51.6,39.9 51.6,39.3 68.55,9.9 68.55,9.3 58.05,2.7 58.05,2.1 43.65,5.4 44.25,5.4
  pour Route2: 40.24,-0.03 69.8,0.37 69.89,89.83 40.13,89.96
  pour Bottom (rank 2): 16.34,48.75 38.44,48.68 38.18,0.05 10.68,0.25 10.68,9.69 16.3,9.64
  pour Route2: 35.41,56.42 40.44,56.4 40.67,39.36 33.89,39.5 33.97,46.24
  pour Route2 (rank 2): 16.24,48.05 38.24,48.11 38.18,0.05 10.68,0.25 10.68,9.69 16.3,9.64
  pour Bottom: 11.85,9.65 11.85,13.64 12.81,14.59 16.16,14.59 17.21,15.65 18.05,15.65 18.23,15.47 18.23,9.55 17.79,9.11 12.27,9.11 12.23,9.07
  pour Bottom (isolate 0.61): 38.37,47.89 38.37,56.28 31.17,56.32 31.17,47.48 30.57,47.44 30.57,47.13 38.1,47.13
  pour Route2 (isolate 0.61): 38.37,47.89 38.37,56.28 31.3,56.47 31.3,47.63 30.57,47.44 30.57,47.13 38.1,47.13
HEATER1
  Top 0.305: R19.1 58.1,36.16
  Top 0.406: R19.1 60.49,36.11 61.35,35.25 J3.1
IN-OUT  (2 unrouted)
  Top 0.254: 45.61,51.23 38.12,51.23 37.52,50.64 34.37,50.64 U$3.P$1
  Top 0.305: R11.1 51.8,51.92 51.8,48.1 51.69,47.99 | 45.61,51.23 U$4.1 45.49,51.11 CIN3.1 | U$5.5 46.42,33.67 CIN.1 | U$5.3 46.38,34.67 CIN.1 | R10.1 53.75,48 53.73,47.99 | U$5.4 48.2,34.19 CIN.1 | U$7.P$28 U$7.P$23 U$7.P$26 | U$7.P$26 U$7.P$21 U$7.P$18 8.05,25.93 8.05,25.96 U$7.P$20 | U$7.P$26 U$7.P$29 | U$7.P$26 U$7.P$31 7.91,31.03 5.48,28.59
  Top 0.813: R12.1 55.76,50.01 53.75,48 | 53.73,47.99 51.91,47.99 51.8,48.1
  Top 1.016: U$3.P$1 34.31,50.58 34.31,48.82 35.14,47.99 41.73,47.99 | 41.73,47.99 51.69,47.99 | 45.89,34.17 CIN.1 45.82,34.27 41.73,34.27 | 41.73,47.99 41.73,34.27 | 41.73,34.27 41.73,26.82 43.5,25.05 45.78,25.05 R6.2
N$2  (via drill 2.5)
  other vias: 22.9,45
N$3
  Top 0.406: R5.1 62.73,45.3 J1.1
N$4
  Top 0.305: R7.1 56.9,17.71 C1.1 54.39,16.79 U$8.P$1
N$5
  Top 0.305: U$8.P$2 54.62,18.51 C1.2 C2.1 57.03,20.7 R8.1
N$6
  Top 0.305: C3.1 47.52,20.09 47.54,18.48 | 47.54,18.48 RVD.1 | U$8.P$6 50.12,18.46 47.54,18.48
N$7
  Top 0.305: Q1.3 48.52,25.86 50.77,28.11 R16.1
N$8
  Top 0.305: U$8.P$4 53.32,20.94 C4.1
N$9
  Top 0.305: 56.3,36.11 R19.2 | U$5.7 52.68,34.17 COUT.1 | U$5.8 52.19,34.67 COUT.1 | U$5.6 52.18,33.67 COUT.1
  Top 0.406: COUT.1 52.68,33.65
  Top 1.016: COUT.1 52.72,33.91 R20.2 56.25,33.96 R19.2 56.2,36.16 R18.2 R5.2
N$10
  Top 0.305: U$5.10 50.98,35.68 RLIM.1
N$11
  Top 0.305: R18.1 58.09,38.42
  Top 0.406: R18.1 59.71,38.41 61.5,40.2 J2.1
N$12
  Top 0.406: R20.1 61.96,30.15 J4.1
N$14  (1 unrouted)
N$15  (1 unrouted)
N$16  (via drill 2.5)
  other vias: 78.8,45
N$17  (via drill 2.5)
  other vias: 78.8,65.33
N$18  (via drill 2.5)
  other vias: 78.8,24.67
N$19  (1 unrouted)
N$20  (1 unrouted)
N$21  (1 unrouted)
N$22  (1 unrouted)
N$23
  Top 0.254: U$10.2 66,6.6 65.4,7.2 62.7,7.2 | 62.7,7.2 61.8,8.1 61.8,9.55 R27.2 R24.1 | 62.7,7.2 TP1.TP 59.9,4.45 VR1.3 55.47,6.3 47.55,6.3 46.05,4.8 R26.1
N$24
  Top 0.254: R25.1 R26.2 48.85,2.65 TP4.TP 49.95,3.45 VR1.2 54,1.95 54.75,1.2 61.95,1.2 63.46,2.71 U$10.3
OUT  (via drill 0.3)  (3 unrouted)
  Top 0.254: U$8.P$5 50.17,16.5 50.18,16.5 50.18,15.97
  other vias: 50.17,16.79 50.17,16.19
SCL  (1 unrouted)
  Top 0.305: U$4.4 48.74,51.35 49.16,51.83 48.84,51.35 50.46,53.79 51.64,53.79 R11.2
SDA  (2 unrouted)
  Top 0.254: U$4.5 48.21,55.07 48.25,55.07 53.26,55.07 53.75,54.59 R10.2
  Top 0.305: 48.91,55.06 48.84,55.08 48.87,55.08
SYNC1  (1 unrouted)
SYNC2  (1 unrouted)
TOVER  (1 unrouted)
  Top 0.254: R4.2 47.25,37.85 47.25,35.55 47.63,35.17 U$5.2
V-BATT  (via drill 0.3, 2.7)  (2 unrouted)
  Top 0.254: 45.71,54.08 35.48,54.08 34.35,55.2 34.35,58.87 U$3.P$2
  Top 0.305: 45.71,54.08 U$4.8 | RVD.2 48.23,15.19 | v58.8,16.34 58.8,16.37 58.76,16.33 58.7,16.33 | 58.7,16.33 R7.2 | 58.7,16.33 58.71,16.34 v59.73,16.34
  Top 0.406: R7.2 56.09,15.19 53.42,15.19 48.23,15.19
  Top 0.61: 26.95,60.43 26.95,50.66 26.92,50.63 | 29.03,58.02 24.6,58.02 24.54,58.08 | 29.18,52.83 24.68,52.83 24.65,52.8 24.6,52.8 24.54,52.74 24.45,52.74 24.45,52.72 24.51,52.66 | 29.18,77.98 24.94,77.98 | 27.03,80.28 27.03,70.73 | 29.35,72.88 24.83,72.88 24.77,72.94
  Bottom 0.813: 26.92,50.7 26.92,80.54 26.83,80.54 26.83,80.39 26.76,80.39 | 24.99,77.96 24.99,77.88 29.24,77.88 | 24.99,72.75 29.24,72.75 | 24.91,57.89 29.16,57.89 | 24.88,52.93 29.13,52.93
  other vias: 24,51 24,56 24,61 20,61 28,61 28,66 24,66 20,66 20,70 24,70 28,70 24,74 24,78 23.7,87 34.5,87
  pour Top: 29.61,49.99 29.61,89.66 16.69,89.66 16.69,49.58 29.57,49.58 29.57,49.77
  pour Top: 37.89,57.53 37.99,89.96 30.89,89.95 30.89,57.54 37.34,57.54
  pour Bottom (isolate 0.254): 29.61,49.99 29.61,89.06 16.69,89.06 16.69,49.58 29.57,49.58 29.57,49.77
VOLTAGE-ADC  (1 unrouted)
  Top 0.305: R1.1 53.24,43.44 R2.2 55.89,43.46 C5.1
VOLTAGE-ADC_FILTERED  (2 unrouted)
VTEMP  (1 unrouted)
  Top 0.254: R28.2 R27.1
VTEMP_FILTERED  (2 unrouted)
  Bottom 0.254: 64.07,63.04 U$1.P1.0_A0

### Text on the board
tSilk: HuskySat | Battery Board | V4 | IN-OUT | IN-OUT | ALCC | SDA | SCL | ADC | out | CB-EN | LDO-EN | TRIP-TEST | LDO | HEAT | TPS709 | GND
_tsilk: V-TEMP | T-under